# Altium schematic sheet HeadersTeensy3.2.SchDoc
size 304 x 381 mm
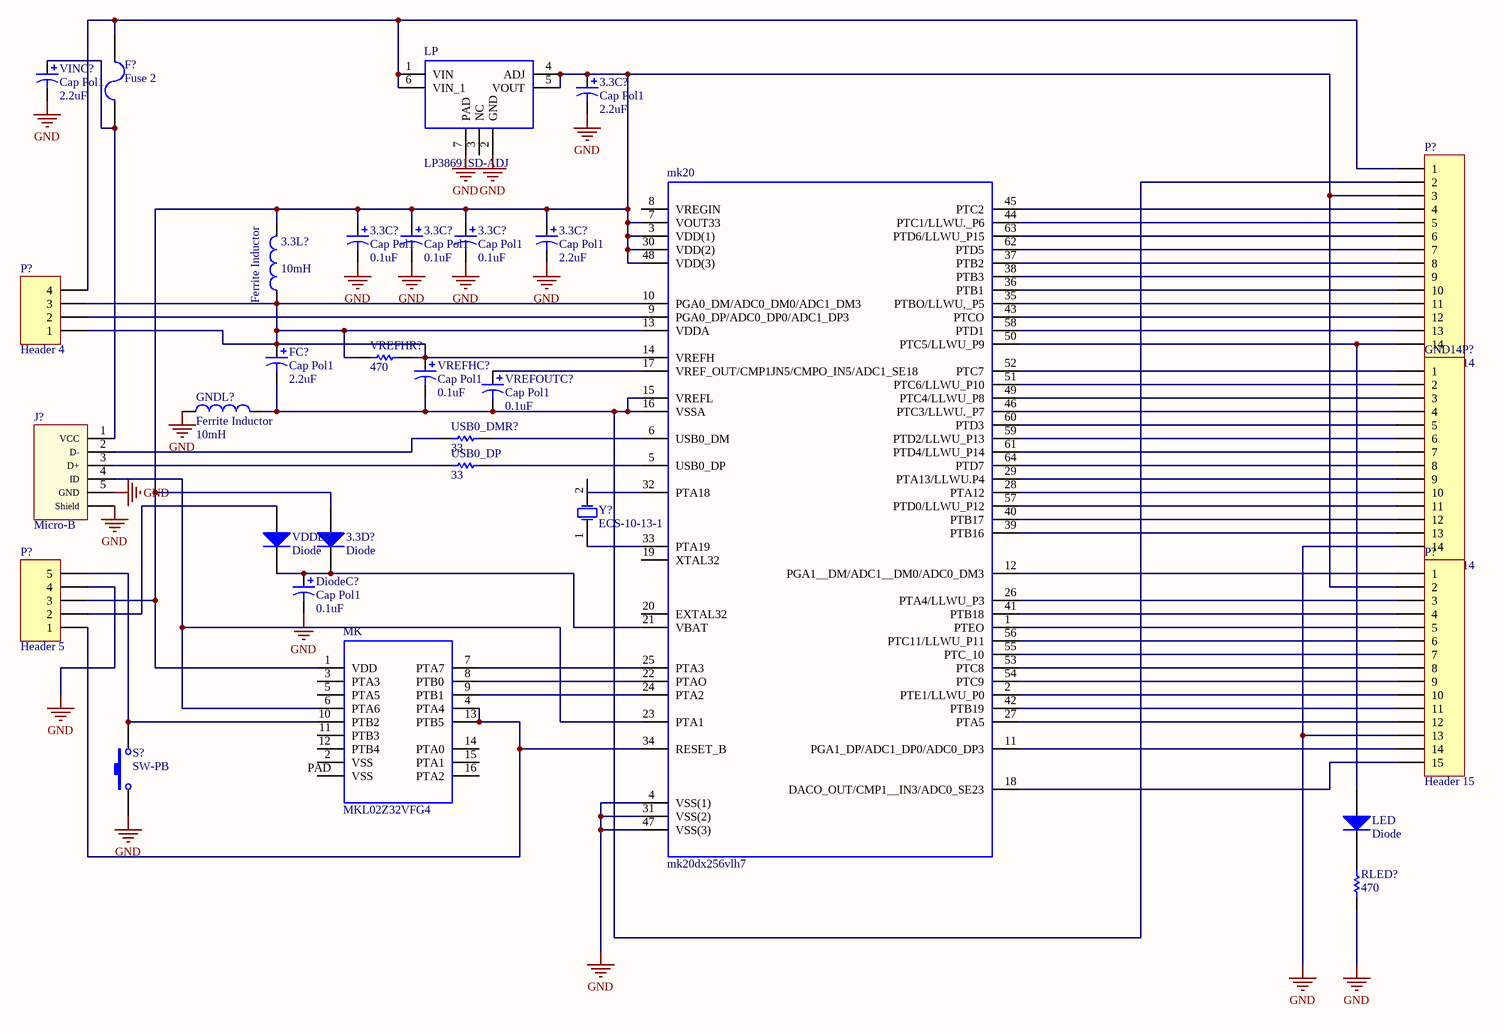
[diagram p0: HeadersTeensy3.2.SchDoc]

## Parts
(Parts that share a designator on the sheet are numbered #1, #2 ... from top to bottom, then left to right.)
3.3C?#1  Cap Pol1  value 2.2uF  [RAD-0.2]
3.3C?#2  Cap Pol1  value 0.1uF  [RAD-0.1]
3.3C?#3  Cap Pol1  value 0.1uF  [RAD-0.1]
3.3C?#4  Cap Pol1  value 0.1uF  [RAD-0.1]
3.3C?#5  Cap Pol1  value 2.2uF  [RAD-0.2]
3.3D?  Diode  [SMC]
3.3L?  Ferrite Inductor  value 10mH  [0402-A]
DiodeC?  Cap Pol1  value 0.1uF  [RAD-0.1]
F?  Fuse 2  [PIN-W2/E2.8]
FC?  Cap Pol1  value 2.2uF  [RAD-0.2]
GND14P?  Header 14  [HDR1X14]
GNDL?  Ferrite Inductor  value 10mH  [0402-A]
J?  Micro-B  [629105136821]
LED  Diode  [SMC]
LP  LP38691SD-ADJ  [SON95P300X300X80-7N]
MK  MKL02Z32VFG4  [QFN50P300X300X65-17N-D]
mk20  mk20dx256vlh7  [QFP50P1200X1200X160-64N]
P?#1  Header 14  [HDR1X14]
P?#2  Header 4  [HDR1X4]
P?#3  Header 15  [HDR1X15]
P?#4  Header 5  [HDR1X5]
RLED?  470  [AXIAL-0.3]
S?  SW-PB  [SPST-2]
USB0_DMR?  33  [AXIAL-0.3]
USB0_DP  33  [AXIAL-0.3]
VDDD?  Diode  [SMC]
VINC?  Cap Pol1  value 2.2uF  [RAD-0.2]
VREFHC?  Cap Pol1  value 0.1uF  [RAD-0.1]
VREFHR?  470  [AXIAL-0.3]
VREFOUTC?  Cap Pol1  value 0.1uF  [RAD-0.1]
Y?  ECS-10-13-1  [HC-49U]

## Nets
GND: 3.3C?#1.2 3.3C?#2.2 3.3C?#3.2 3.3C?#4.2 3.3C?#5.2 DiodeC?.2 GND14P?.14 GNDL?.1 J?.5(GND) J?.Shell(Shield) LP.2(GND) LP.7(PAD) mk20.4(VSS(1)) mk20.31(VSS(2)) mk20.47(VSS(3)) P?#3.13 P?#4.4 RLED?.1 S?.1 VINC?.2
Net3.3C?#1_1: 3.3C?#1.1 3.3C?#2.1 3.3C?#3.1 3.3C?#4.1 3.3C?#5.1 3.3D?.1(A) 3.3L?.2 LP.4(ADJ) LP.5(VOUT) MK.1(VDD) mk20.3(VDD(1)) mk20.7(VOUT33) mk20.30(VDD(2)) mk20.48(VDD(3)) P?#1.3 P?#3.2 P?#4.3
Net3.3D?_2: 3.3D?.2(K) DiodeC?.1 mk20.21(VBAT) VDDD?.2(K)
Net3.3L?_1: 3.3L?.1 FC?.1 mk20.10(PGA0_DM/ADC0_DM0/ADC1_DM3) mk20.13(VDDA) mk20.14(VREFH) P?#2.1 P?#2.3 VREFHC?.1 VREFHR?.1 VREFHR?.2
NetF?_1: F?.1 J?.1(VCC) VINC?.1
NetF?_2: F?.2 LP.1(VIN) LP.6(VIN_1) P?#1.1 P?#2.4
NetFC?_2: FC?.2 GNDL?.2 mk20.15(VREFL) mk20.16(VSSA) P?#1.2 VREFHC?.2 VREFOUTC?.2
NetGND14P?_1: GND14P?.1 mk20.52(PTC7)
NetGND14P?_2: GND14P?.2 mk20.51(PTC6/LLWU_P10)
NetGND14P?_3: GND14P?.3 mk20.49(PTC4/LLWU_P8)
NetGND14P?_4: GND14P?.4 mk20.46(PTC3/LLWU._P7)
NetGND14P?_5: GND14P?.5 mk20.60(PTD3)
NetGND14P?_6: GND14P?.6 mk20.59(PTD2/LLWU_P13)
NetGND14P?_7: GND14P?.7 mk20.61(PTD4/LLWU_P14)
NetGND14P?_8: GND14P?.8 mk20.64(PTD7)
NetGND14P?_9: GND14P?.9 mk20.29(PTA13/LLWU.P4)
NetGND14P?_10: GND14P?.10 mk20.28(PTA12)
NetGND14P?_11: GND14P?.11 mk20.57(PTD0/LLWU_P12)
NetGND14P?_12: GND14P?.12 mk20.40(PTB17)
NetGND14P?_13: GND14P?.13 mk20.39(PTB16)
NetJ?_2: J?.2(D-) USB0_DMR?.1
NetJ?_3: J?.3(D+) USB0_DP.1
NetJ?_4: J?.4(ID) MK.6(PTA6) mk20.23(PTA1)
NetLED_1: LED.1(A) mk20.50(PTC5/LLWU_P9) P?#1.14
NetLED_2: LED.2(K) RLED?.2
Netmk20_1: mk20.1(PTEO) P?#3.5
Netmk20_2: mk20.2(PTE1/LLWU_P0) P?#3.10
Netmk20_5: mk20.5(USB0_DP) USB0_DP.2
Netmk20_6: mk20.6(USB0_DM) USB0_DMR?.2
Netmk20_9: mk20.9(PGA0_DP/ADC0_DP0/ADC1_DP3) P?#2.2
Netmk20_11: mk20.11(PGA1_DP/ADC1_DP0/ADC0_DP3) P?#3.14
Netmk20_12: mk20.12(PGA1__DM/ADC1__DM0/ADC0_DM3) P?#3.1
Netmk20_17: mk20.17(VREF_OUT/CMP1JN5/CMPO_IN5/ADC1_SE18) VREFOUTC?.1
Netmk20_18: mk20.18(DACO_OUT/CMP1__IN3/ADC0_SE23) P?#3.15
Netmk20_26: mk20.26(PTA4/LLWU_P3) P?#3.3
Netmk20_27: mk20.27(PTA5) P?#3.12
Netmk20_32: mk20.32(PTA18) Y?.2(OSC2)
Netmk20_33: mk20.33(PTA19) Y?.1(OSC1)
Netmk20_35: mk20.35(PTBO/LLWU,_P5) P?#1.11
Netmk20_36: mk20.36(PTB1) P?#1.10
Netmk20_37: mk20.37(PTB2) P?#1.8
Netmk20_38: mk20.38(PTB3) P?#1.9
Netmk20_41: mk20.41(PTB18) P?#3.4
Netmk20_42: mk20.42(PTB19) P?#3.11
Netmk20_43: mk20.43(PTCO) P?#1.12
Netmk20_44: mk20.44(PTC1/LLWU._P6) P?#1.5
Netmk20_45: mk20.45(PTC2) P?#1.4
Netmk20_53: mk20.53(PTC8) P?#3.8
Netmk20_54: mk20.54(PTC9) P?#3.9
Netmk20_55: mk20.55(PTC_10) P?#3.7
Netmk20_56: mk20.56(PTC11/LLWU_P11) P?#3.6
Netmk20_58: mk20.58(PTD1) P?#1.13
Netmk20_62: mk20.62(PTD5) P?#1.7
Netmk20_63: mk20.63(PTD6/LLWU_P15) P?#1.6
NetMK_4: MK.4(PTA4) MK.13(PTB5) mk20.34(RESET_B) P?#4.1
NetMK_7: MK.7(PTA7) mk20.25(PTA3)
NetMK_8: MK.8(PTB0) mk20.22(PTAO)
NetMK_9: MK.9(PTB1) mk20.24(PTA2)
NetMK_10: MK.10(PTB2) P?#4.5 S?.2
NetP?#4_2: P?#4.2 VDDD?.1(A)

Not connected (* = marked no-connect by the designer): LP 3(NC); MK 2(VSS) 3(PTA3) 5(PTA5) 11(PTB3) 12(PTB4) 14(PTA0) 15(PTA1) 16(PTA2) PAD(VSS); mk20 8(VREGIN) 19(XTAL32) 20(EXTAL32)

## Library data of the parts
3.3C?#1-3.3C?#5 DiodeC? FC? VINC? VREFHC? VREFOUTC? = Cap Pol1: Polarized Capacitor (Radial); Published: 8-Jun-2000; LatestRevisionDate: 17-Jul-2002; LatestRevisionNote: Re-released for DXP Platform.; PackageReference: RB7.6-15; Publisher: Altium Limited; PackageDescription: Polarized Capacitor (Radial); 2 Leads
3.3D? LED VDDD? = Diode: Default Diode; Published: 8-Jun-2000; LatestRevisionDate: 17-Jul-2002; LatestRevisionNote: Re-released for DXP Platform.; PackageVersion: Sep-1996; PackageReference: SMC; Publisher: Altium Limited; PackageDescription: DO-214-AB/SMC; 2 C-Bend Leads; Body 7.9 x 5.9 mm, inc. leads (LxW); Code_JEDEC: DO-214-AB
3.3L? GNDL? = Inductor: Code_IEC: 1005; Published: 8-Jun-2000; LatestRevisionDate: 29-May-2009; LatestRevisionNote: IPC-7351 Footprint Added.; PackageReference: 0402-A; Publisher: Altium Limited; PackageDescription: Chip Inductor; Code_JEITA: 0402
F? = Fuse 2: Fuse; Published: 8-Jun-2000; LatestRevisionDate: 17-Jul-2002; LatestRevisionNote: Re-released for DXP Platform.; PackageReference: PIN-W2/E2.8; Publisher: Altium Limited; PackageDescription: Thru-Hole; 2 Leads
GND14P? P?#1 = Header 14: Header, 14-Pin; LatestRevisionDate: 17-Jul-2002; LatestRevisionNote: Re-released for DXP Platform.; Publisher: Altium Limited
J? = 629105136821: Micro USB 2.0 SMT Type B Horizontal 5 Contacts WR-COM; Interface Type: Type B; Gender: Receptacle; ComponentLink1Description: Manufacturer; ComponentLink1URL: http://www.we-online.de; ComponentLink2Description: Datasheet; ComponentLink2URL: http://katalog.we-online.de/em/datasheet/629105136821.pdf; Part Number: 629105136821; Published Date: April 2017; Publisher: Wurth Elektronik; Sub-Family: Micro USB 2.0; Type: Horizontal; Construction: SMT
LP = LP38691SD-ADJ: 500mA LDO Regulator Adj.,LP38691SD-ADJ; Manufacturer_Name: Texas Instruments; Geometry.Height: 0.8mm; Supplier_Name: Mouser; Mouser Part Number: 926-LP38691SD-ADJ; Manufacturer_Part_Number: LP38691SD-ADJ; Datasheet Link: http://www.ti.com/lit/ds/symlink/lp38691-adj.pdf; 3D Package: *
MK = MKL02Z32VFG4: Freescale MKL02Z32VFG4, 32bit ARM Cortex M0 Microcontroller, 48MHz, 32 kB Flash, 16-Pin QFN; Manufacturer_Name: Nexperia; Geometry.Height: 0.65mm; Supplier_Name: RS; RS Part Number: 7884723; Manufacturer_Part_Number: MKL02Z32VFG4; Allied_Number: *; Other Part Number: *; Datasheet Link: http://cache.nxp.com/files/32bit/doc/data_sheet/KL02P32M48SF0.pdf; 3D Package: *
mk20 = mk20dx256vlh7: MK20DX256VLH7, ARM Cortex M4 MCU 72MHz 256 kB Flash, 64 kB RAM, USB CAN I2C 64-Pin LQFP; Manufacturer_Name: Nexperia; Geometry.Height: 1.6mm; Supplier_Name: RS; RS Part Number: 7862120P; Manufacturer_Part_Number: mk20dx256vlh7; Allied_Number: *; Other Part Number: *; Datasheet Link: https://www.pjrc.com/teensy/K20P64M72SF1.pdf; 3D Package: *
P?#2 = Header 4: Header, 4-Pin; LatestRevisionDate: 17-Jul-2002; LatestRevisionNote: Re-released for DXP Platform.; Publisher: Altium Limited
P?#3 = Header 15: Header, 15-Pin; LatestRevisionDate: 17-Jul-2002; LatestRevisionNote: Re-released for DXP Platform.; Publisher: Altium Limited
P?#4 = Header 5: Header, 5-Pin; LatestRevisionDate: 17-Jul-2002; LatestRevisionNote: Re-released for DXP Platform.; Publisher: Altium Limited
RLED? USB0_DMR? USB0_DP VREFHR? = Res1: Resistor; Published: 8-Jun-2000; LatestRevisionDate: 17-Jul-2002; LatestRevisionNote: Re-released for DXP Platform.; PackageReference: AXIAL-0.3; Publisher: Altium Limited; PackageDescription: Axial Device, Thru-Hole; 2 Leads; 0.3 in Pin Spacing
S? = SW-PB: Switch; Published: 24-Mar-1999; LatestRevisionDate: 17-Jul-2002; LatestRevisionNote: Re-released for DXP Platform.; PackageReference: SPST-2; Publisher: Altium Limited; PackageDescription: Switch; 2 Leads
Y? = ECS-10-13-1: Crystal Oscillator; Published: 17-Jul-2002; DatasheetDocument: 18-Apr-2000; PackageReference: HC-49U; Publisher: Altium Limited; ComponentLink1Description: Manufacturer Link; ComponentLink1URL: http://www.ecsxtal.com/; ComponentLink2Description: Datasheet; ComponentLink2URL: http://www.ecsxtal.com/pdf2/HC49U.PDF